# Altium project Decode_pcb.PrjPcb
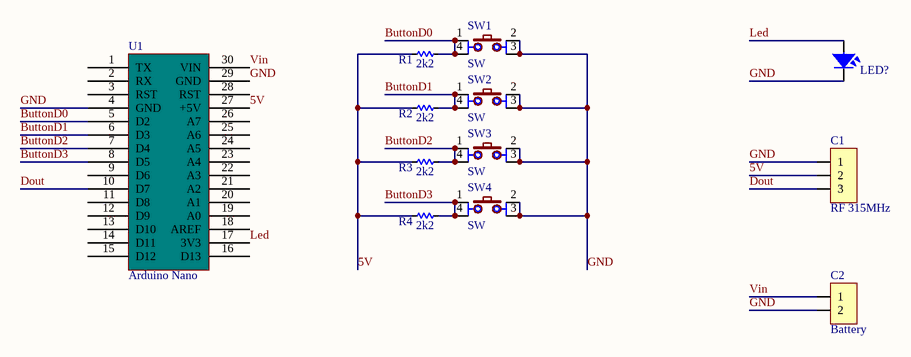
[diagram p0: Sheet1.SchDoc]
1 sheet, 12 parts. Net scope: global (net labels, ports and power ports of the same name join across sheets).
Board file: Sheet1.PcbDoc

## Sheet Sheet1.SchDoc
size A; SheetNumber: 1; SheetTotal: 1

### Parts
C1  RF 315MHz  [JP3-C1C]
C2  Battery  [JP2-C1C]
LED?  LED  [LED-5-WHITE]  (value not drawn)
R1  2k2  [RES-1/4W]
R2  2k2  [RES-1/4W]
R3  2k2  [RES-1/4W]
R4  2k2  [RES-1/4W]
SW1  SW  [SW2-DIP]
SW2  SW  [SW2-DIP]
SW3  SW  [SW2-DIP]
SW4  SW  [SW2-DIP]
U1  Arduino Nano  [PCBComponent_1]

### Nets
5V: C1.2 R1.2 R2.2 R3.2 R4.2 U1.27(+5V)
ButtonD0: R1.1 SW1.1 SW1.4 U1.5(D2)
ButtonD1: R2.1 SW2.1 SW2.4 U1.6(D3)
ButtonD2: R3.1 SW3.1 SW3.4 U1.7(D4)
ButtonD3: R4.1 SW4.1 SW4.4 U1.8(D5)
Dout: C1.3 U1.10(D7)
GND: C1.1 C2.2 LED?.2 SW1.2 SW1.3 SW2.2 SW2.3 SW3.2 SW3.3 SW4.2 SW4.3 U1.4(GND) U1.29(GND)
Led: LED?.1 U1.17(3V3)
Vin: C2.1 U1.30(VIN)

Not connected (* = marked no-connect by the designer): U1 1(TX) 2(RX) 3(RST) 9(D6) 11(D8) 12(D9) 13(D10) 14(D11) 15(D12) 16(D13) 18(AREF) 19(A0) 20(A1) 21(A2) 22(A3) 23(A4) 24(A5) 25(A6) 26(A7) 28(RST)

### Library data of the parts
C1 = JP3: WR-PHD 2.54 mm Angled Socket Header; Manufacturer: W¨¹rth Elektronik eiSos GmbH; partNo: 613003143121; ComponentLink1 Description: Manufacturer; ComponentLink2 Description: Datasheet; NoPins: 03; Created Date: 29 March 2013; ComponentLink1URL: http://www.we-online.com; ComponentLink2URL: http://katalog.we-online.de/em/datasheet/6130xx143121.pdf; Created by: Karrer Zheng
C2 = JP2: WR-PHD 2.54 mm Angled Socket Header; Manufacturer: W¨¹rth Elektronik eiSos GmbH; partNo: 613002143121; ComponentLink1 Description: Manufacturer; ComponentLink2 Description: Datasheet; NoPins: 02; Created Date: 29 March 2013; ComponentLink1URL: http://www.we-online.com; ComponentLink2URL: http://katalog.we-online.de/em/datasheet/6130xx143121.pdf; Created by: Karrer Zheng
LED? = LED: LED Single colour Green and Red; Value: LED 3 ly Single Colour
R1-R4 = Res: Manufacturer: Generic Components; Class: Passive; SubClass: R; Published: 08/06/2000; Publisher: Altium Hobart Technology Centre
SW1-SW4 = SW4: Switch button 4 pin; Value: Button chip 4 pin
U1 = Component_1